# EAGLE schematic smarty_sup02 (EAGLE 6.5.0)
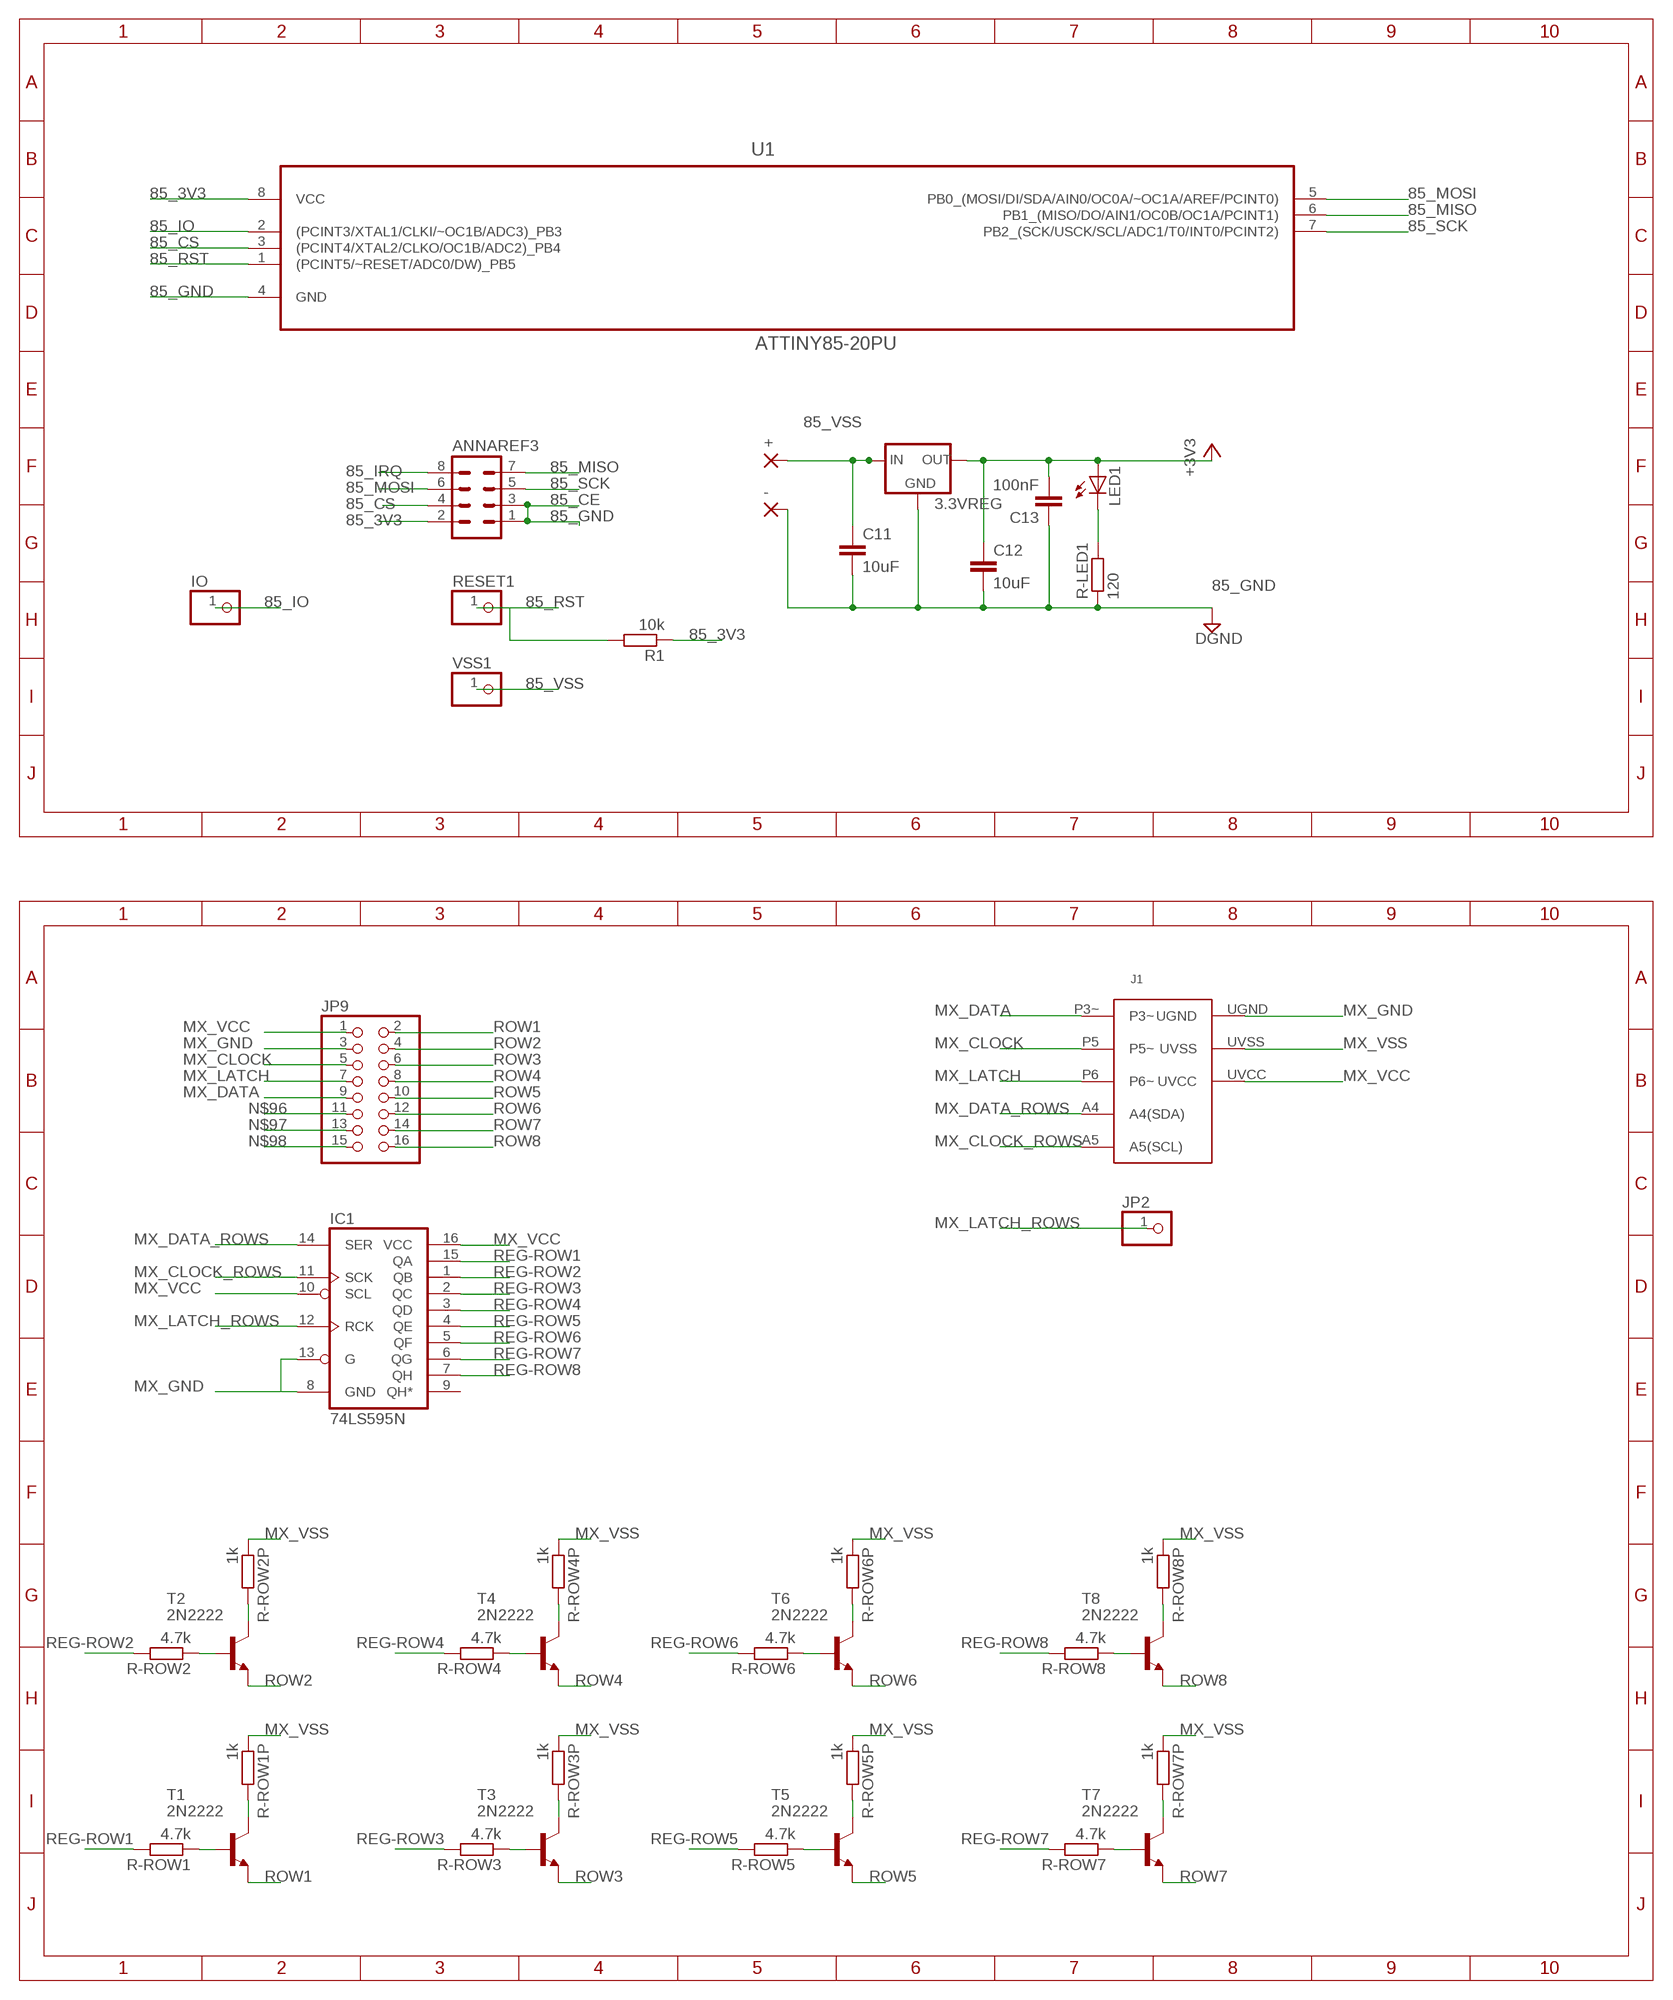
[diagram p0: schematic, sheet 1]

## Parts
3.3VREG  78LXX  [78LXX]
+  2,54/1,1  [2,54/1,1]
-  2,54/1,1  [2,54/1,1]
ANNAREF3  MA04-2  [MA04-2]
C11  10uF  C-EU025-050X050  [C025-050X050]
C12  10uF  C-EU025-050X050  [C025-050X050]
C13  100nF  C-EU050-024X044  [C050-024X044]
IC1  74LS595N  [DIL16]
IO  PINHD-1X1  [1X01]
J1  SMARTY-USHIELD  [SMARTY-USHIELD-2.54]
JP2  PINHD-1X1  [1X01]
JP9  PINHD-2X8  [2X08]
LED1  LED3MM  [LED3MM]
R1  10k  R-EU_0204/2V  [0204V]
R-LED1  120  R-EU_0204/2V  [0204V]
R-ROW1  4.7k  R-EU_M1206  [M1206]
R-ROW1P  1k  R-EU_M1206  [M1206]
R-ROW2  4.7k  R-EU_M1206  [M1206]
R-ROW2P  1k  R-EU_M1206  [M1206]
R-ROW3  4.7k  R-EU_M1206  [M1206]
R-ROW3P  1k  R-EU_M1206  [M1206]
R-ROW4  4.7k  R-EU_M1206  [M1206]
R-ROW4P  1k  R-EU_M1206  [M1206]
R-ROW5  4.7k  R-EU_M1206  [M1206]
R-ROW5P  1k  R-EU_M1206  [M1206]
R-ROW6  4.7k  R-EU_M1206  [M1206]
R-ROW6P  1k  R-EU_M1206  [M1206]
R-ROW7  4.7k  R-EU_M1206  [M1206]
R-ROW7P  1k  R-EU_M1206  [M1206]
R-ROW8  4.7k  R-EU_M1206  [M1206]
R-ROW8P  1k  R-EU_M1206  [M1206]
RESET1  PINHD-1X1  [1X01]
T1  2N2222  [TO92-EBC-OVAL]
T2  2N2222  [TO92-EBC-OVAL]
T3  2N2222  [TO92-EBC-OVAL]
T4  2N2222  [TO92-EBC-OVAL]
T5  2N2222  [TO92-EBC-OVAL]
T6  2N2222  [TO92-EBC-OVAL]
T7  2N2222  [TO92-EBC-OVAL]
T8  2N2222  [TO92-EBC-OVAL]
U1  ATTINY85-20PU  [DIP254P762X533-8]
VSS1  PINHD-1X1  [1X01]

## Nets
85_3V3: 3.3VREG.OUT ANNAREF3.2 C12.1 C13.2 LED1.A R1.1 U1.8(VCC) ; supply symbol labelled +3V3
85_CE: ANNAREF3.3
85_CS: ANNAREF3.4 U1.3((PCINT4/XTAL2/CLKO/OC1B/ADC2)_PB4)
85_GND [power]: 3.3VREG.GND -.1(P) ANNAREF3.1 C11.2 C12.2 C13.1 R-LED1.1 U1.4(GND) ; supply symbol labelled DGND
85_IO: IO.1 U1.2((PCINT3/XTAL1/CLKI/~OC1B/ADC3)_PB3)
85_IRQ: ANNAREF3.8
85_MISO: ANNAREF3.7 U1.6(PB1_(MISO/DO/AIN1/OC0B/OC1A/PCINT1))
85_MOSI: ANNAREF3.6 U1.5(PB0_(MOSI/DI/SDA/AIN0/OC0A/~OC1A/AREF/PCINT0))
85_RST: R1.2 RESET1.1 U1.1((PCINT5/~RESET/ADC0/DW)_PB5)
85_SCK: ANNAREF3.5 U1.7(PB2_(SCK/USCK/SCL/ADC1/T0/INT0/PCINT2))
85_VSS: 3.3VREG.IN +.1(P) C11.1 VSS1.1
MX_CLOCK: J1.P5(P5~) JP9.5
MX_CLOCK_ROWS: IC1.11(SCK) J1.A5(A5(SCL))
MX_DATA: J1.P3~ JP9.9
MX_DATA_ROWS: IC1.14(SER) J1.A4(A4(SDA))
MX_GND: IC1.8(GND) IC1.13(G) J1.UGND JP9.3
MX_LATCH: J1.P6(P6~) JP9.7
MX_LATCH_ROWS: IC1.12(RCK) JP2.1
MX_VCC: IC1.10(SCL) IC1.16(VCC) J1.UVCC JP9.1
MX_VSS: J1.UVSS R-ROW1P.1 R-ROW2P.1 R-ROW3P.1 R-ROW4P.1 R-ROW5P.1 R-ROW6P.1 R-ROW7P.1 R-ROW8P.1
N$2: R-ROW2.1 T2.B
N$3: R-ROW1.1 T1.B
N$4: R-ROW1P.2 T1.C
N$5: R-ROW2P.2 T2.C
N$19: R-ROW3.1 T3.B
N$20: R-ROW3P.2 T3.C
N$21: R-ROW4.1 T4.B
N$22: R-ROW4P.2 T4.C
N$23: R-ROW5.1 T5.B
N$24: R-ROW5P.2 T5.C
N$25: R-ROW6.1 T6.B
N$26: R-ROW6P.2 T6.C
N$27: R-ROW7.1 T7.B
N$28: R-ROW7P.2 T7.C
N$29: R-ROW8.1 T8.B
N$30: R-ROW8P.2 T8.C
N$51: LED1.K(C) R-LED1.2
N$96: JP9.11
N$97: JP9.13
N$98: JP9.15
REG-ROW1: IC1.15(QA) R-ROW1.2
REG-ROW2: IC1.1(QB) R-ROW2.2
REG-ROW3: IC1.2(QC) R-ROW3.2
REG-ROW4: IC1.3(QD) R-ROW4.2
REG-ROW5: IC1.4(QE) R-ROW5.2
REG-ROW6: IC1.5(QF) R-ROW6.2
REG-ROW7: IC1.6(QG) R-ROW7.2
REG-ROW8: IC1.7(QH) R-ROW8.2
ROW1: JP9.2 T1.E
ROW2: JP9.4 T2.E
ROW3: JP9.6 T3.E
ROW4: JP9.8 T4.E
ROW5: JP9.10 T5.E
ROW6: JP9.12 T6.E
ROW7: JP9.14 T7.E
ROW8: JP9.16 T8.E
Unconnected: IC1.9(QH*)

## Library data of the parts
3.3VREG = v-reg:78LXX: VOLTAGE REGULATOR
+ - = wirepad:2,54/1,1: THROUGH-HOLE PAD
ANNAREF3 = con-lstb:MA04-2: PIN HEADER; OC_FARNELL: unknown; OC_NEWARK: unknown
C11-C13 = rcl:C-EU: CAPACITOR, European symbol
IC1 = SparkFun-DigitalIC:74*595: 8-bit SHIFT REGISTER, output latch
IO JP2 RESET1 VSS1 = pinhead:PINHD-1X1: PIN HEADER
J1 = smarties:SMARTY-USHIELD: Smarty uShield Header (0.1") This is a pin header with 0.1" (2.54 mm) standard pin steps for Smarty micro-shields. Design : David Lyszyk
JP9 = pinhead:PINHD-2X8: PIN HEADER
LED1 = led:LED: LED OSRAM: - CHIPLED LG R971, LG N971, LY N971, LG Q971, LY Q971, LO R971, LY R971 LH N974, LH R974 LS Q976, LO Q976, LY Q976 LO Q996 - Hyper CHIPLED LW Q18S LB Q993, LB Q99A, LB R99A - SideLED LS A670, LO A670, LY A670, LG A670, LP A670 LB A673, LV A673, LT A673, LW A673 LH A674 LY A675 LS A676, LA A676, LO A676, LY A676, LW A676 LS A679, LY A679, LG A679 - Hyper Micro SIDELED® LS Y876, LA Y876, LO Y876, LY Y876 LT Y87S - SmartLED LW L88C, LW L88S LB L89C, LB L89S, LG L890 LS L89K, LO L89K, LY L89K LS L896, LA L896, LO L896, LY L896 - TOPLED LS T670, LO T670, LY T670, LG T670, LP T670 LSG T670, LSP T670, LSY T670, LOP T670, LYG T670 LG T671, LOG T671, LSG T671 LB T673, LV T673, LT T673, LW T673 LH T674 LS T676, LA T676, LO T676, LY T676, LB T676, LH T676, LSB T676, LW T676 LB T67C, LV T67C, LT T67C, LS T67K, LO T67K, LY T67K, LW E67C LS E67B, LA E67B, LO E67B, LY E67B, LB E67C, LV E67C, LT E67C LW T67C LS T679, LY T679, LG T679 LS T770, LO T770, LY T770, LG T770, LP T770 LB T773, LV T773, LT T773, LW T773 LH T774 LS E675, LA E675, LY E675, LS T675 LS T776, LA T776, LO T776, LY T776, LB T776 LHGB T686 LT T68C, LB T68C - Hyper Mini TOPLED® LB M676 - Mini TOPLED Santana® LG M470 LS M47K, LO M47K, LY M47K Source: http://www.osram.convergy.de LUXEON: - LUMILED® LXK2-PW12-R00, LXK2-PW12-S00, LXK2-PW14-U00, LXK2-PW14-V00 LXK2-PM12-R00, LXK2-PM12-S00, LXK2-PM14-U00 LXK2-PE12-Q00, LXK2-PE12-R00, LXK2-PE12-S00, LXK2-PE14-T00, LXK2-PE14-U00 LXK2-PB12-K00, LXK2-PB12-L00, LXK2-PB12-M00, LXK2-PB14-N00, LXK2-PB14-P00, LXK2-PB14-Q00 LXK2-PR12-L00, LXK2-PR12-M00, LXK2-PR14-Q00, LXK2-PR14-R00 LXK2-PD12-Q00, LXK2-PD12-R00, LXK2-PD12-S00 LXK2-PH12-R00, LXK2-PH12-S00 LXK2-PL12-P00, LXK2-PL12-Q00, LXK2-PL12-R00 Source: www.luxeon.com KINGBRIGHT: KA-3528ASYC Source: www.kingbright.com
R1 R-LED1 R-ROW1 R-ROW1P R-ROW2 R-ROW2P R-ROW3 R-ROW3P R-ROW4 R-ROW4P R-ROW5 R-ROW5P R-ROW6 R-ROW6P R-ROW7 R-ROW7P R-ROW8 R-ROW8P = resistor:R-EU_: RESISTOR, European symbol
T1-T8 = adafruit:2N2222: NPN TRANSISTOR Big oval pads
U1 = Atmel_By_element14_Batch_1-00:ATTINY85-20PU: 8-bit Microcontroller with In-System Programmable Flash; MPN: ATTINY85-20PU; OC_FARNELL: 1455162; OC_NEWARK: 58M3796; PACKAGE: PDIP-8; SUPPLIER: Atmel

## Net classes
0 default: width 0.203 mm, drill 0.203 mm, clearance 0.152 mm
1 power: width 0.254 mm, drill 0.406 mm, clearance 0.152 mm